# EAGLE design edubrm-shield-debug (EAGLE 5.11)
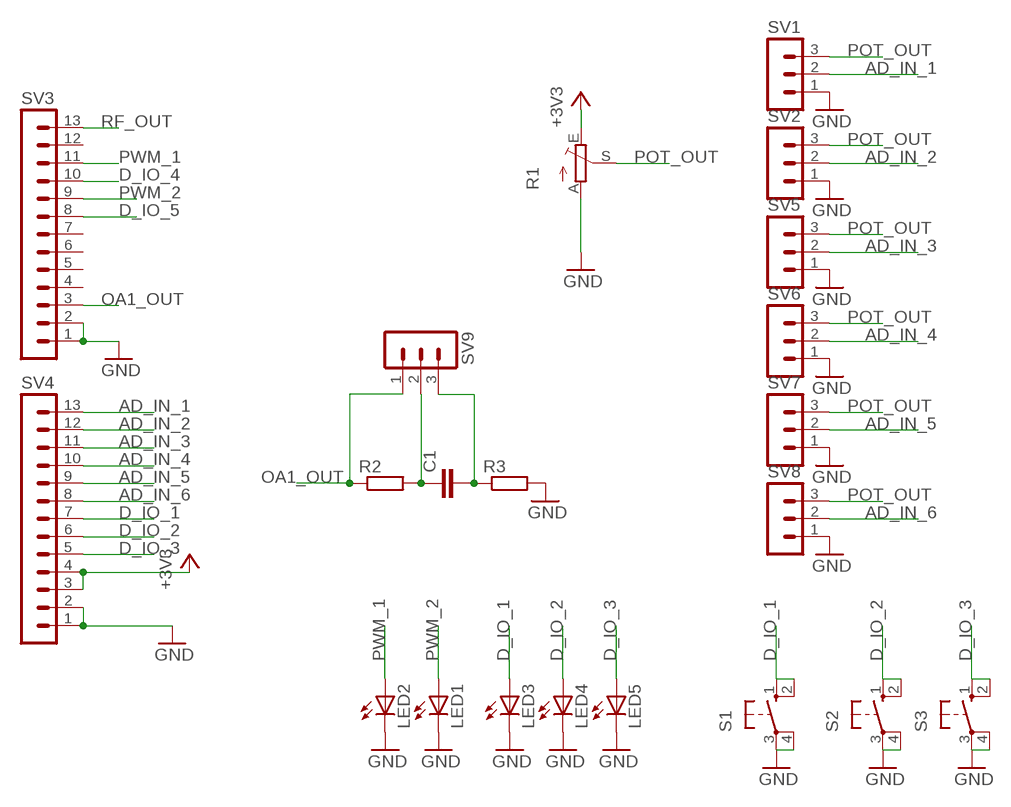
[diagram p0: schematic, sheet 1]

## Parts
C1  C-EU050-024X044  [C050-024X044]
LED1  LED3MM  [LED3MM]
LED2  LED3MM  [LED3MM]
LED3  LED3MM  [LED3MM]
LED4  LED3MM  [LED3MM]
LED5  LED3MM  [LED3MM]
R1  TRIM_EU-CIP20C-6MM  [CIP20C-6MM]
R2  R-EU_0207/10  [0207/10]
R3  R-EU_0207/10  [0207/10]
S1  10-XX  [B3F-10XX]
S2  10-XX  [B3F-10XX]
S3  10-XX  [B3F-10XX]
SV1  MA03-1  [MA03-1]
SV2  MA03-1  [MA03-1]
SV3  MA13-1  [MA13-1]
SV4  MA13-1  [MA13-1]
SV5  MA03-1  [MA03-1]
SV6  MA03-1  [MA03-1]
SV7  MA03-1  [MA03-1]
SV8  MA03-1  [MA03-1]
SV9  MA03-1  [MA03-1]

## Nets
AD_IN_1: SV1.2 SV4.13
AD_IN_2: SV2.2 SV4.12
AD_IN_3: SV4.11 SV5.2
AD_IN_4: SV4.10 SV6.2
AD_IN_5: SV4.9 SV7.2
AD_IN_6: SV4.8 SV8.2
D_IO_1: LED3.A S1.1(S) S1.2(S1) SV4.7
D_IO_2: LED4.A S2.1(S) S2.2(S1) SV4.6
D_IO_3: LED5.A S3.1(S) S3.2(S1) SV4.5
D_IO_4: SV3.10
D_IO_5: SV3.8
GND: LED1.K(C) LED2.K(C) LED3.K(C) LED4.K(C) LED5.K(C) R1.A R3.2 S1.3(P) S1.4(P1) S2.3(P) S2.4(P1) S3.3(P) S3.4(P1) SV1.1 SV2.1 SV3.1 SV3.2 SV4.1 SV4.2 SV5.1 SV6.1 SV7.1 SV8.1
N$1: C1.1 R2.2 SV9.2
N$2: C1.2 R3.1 SV9.3
OA1_OUT: R2.1 SV3.3 SV9.1
POT_OUT: R1.S SV1.3 SV2.3 SV5.3 SV6.3 SV7.3 SV8.3
PWM_1: LED2.A SV3.11
PWM_2: LED1.A SV3.9
RF_OUT: SV3.13
VCC: R1.E SV4.3 SV4.4 ; supply symbol labelled +3V3
Unconnected: SV3.4 SV3.5 SV3.6 SV3.7 SV3.12

## Library data of the parts
C1 = rcl:C-EU: CAPACITOR, European symbol
LED1-LED5 = led:LED: LED OSRAM: - CHIPLED LG R971, LG N971, LY N971, LG Q971, LY Q971, LO R971, LY R971 LH N974, LH R974 LS Q976, LO Q976, LY Q976 LO Q996 - Hyper CHIPLED LW Q18S LB Q993, LB Q99A, LB R99A - SideLED LS A670, LO A670, LY A670, LG A670, LP A670 LB A673, LV A673, LT A673, LW A673 LH A674 LY A675 LS A676, LA A676, LO A676, LY A676, LW A676 LS A679, LY A679, LG A679 - Hyper Micro SIDELED® LS Y876, LA Y876, LO Y876, LY Y876 LT Y87S - SmartLED LW L88C, LW L88S LB L89C, LB L89S, LG L890 LS L89K, LO L89K, LY L89K LS L896, LA L896, LO L896, LY L896 - TOPLED LS T670, LO T670, LY T670, LG T670, LP T670 LSG T670, LSP T670, LSY T670, LOP T670, LYG T670 LG T671, LOG T671, LSG T671 LB T673, LV T673, LT T673, LW T673 LH T674 LS T676, LA T676, LO T676, LY T676, LB T676, LH T676, LSB T676, LW T676 LB T67C, LV T67C, LT T67C, LS T67K, LO T67K, LY T67K, LW E67C LS E67B, LA E67B, LO E67B, LY E67B, LB E67C, LV E67C, LT E67C LW T67C LS T679, LY T679, LG T679 LS T770, LO T770, LY T770, LG T770, LP T770 LB T773, LV T773, LT T773, LW T773 LH T774 LS E675, LA E675, LY E675, LS T675 LS T776, LA T776, LO T776, LY T776, LB T776 LHGB T686 LT T68C, LB T68C - Hyper Mini TOPLED® LB M676 - Mini TOPLED Santana® LG M470 LS M47K, LO M47K, LY M47K Source: http://www.osram.convergy.de LUXEON: - LUMILED® LXK2-PW12-R00, LXK2-PW12-S00, LXK2-PW14-U00, LXK2-PW14-V00 LXK2-PM12-R00, LXK2-PM12-S00, LXK2-PM14-U00 LXK2-PE12-Q00, LXK2-PE12-R00, LXK2-PE12-S00, LXK2-PE14-T00, LXK2-PE14-U00 LXK2-PB12-K00, LXK2-PB12-L00, LXK2-PB12-M00, LXK2-PB14-N00, LXK2-PB14-P00, LXK2-PB14-Q00 LXK2-PR12-L00, LXK2-PR12-M00, LXK2-PR14-Q00, LXK2-PR14-R00 LXK2-PD12-Q00, LXK2-PD12-R00, LXK2-PD12-S00 LXK2-PH12-R00, LXK2-PH12-S00 LXK2-PL12-P00, LXK2-PL12-Q00, LXK2-PL12-R00 Source: www.luxeon.com KINGBRIGHT: KA-3528ASYC Source: www.kingbright.com
R1 = pot:TRIM_EU-: POTENTIOMETER
R2 R3 = rcl:R-EU_: RESISTOR, European symbol
S1-S3 = switch-omron:10-XX: OMRON SWITCH; MPN: B3F-1000; OC_FARNELL: 176432; OC_NEWARK: 36M3542
SV1 SV2 SV5-SV9 = con-lstb:MA03-1: PIN HEADER; OC_FARNELL: unknown; OC_NEWARK: unknown
SV3 SV4 = con-lstb:MA13-1: PIN HEADER; OC_FARNELL: unknown; OC_NEWARK: unknown

## Board
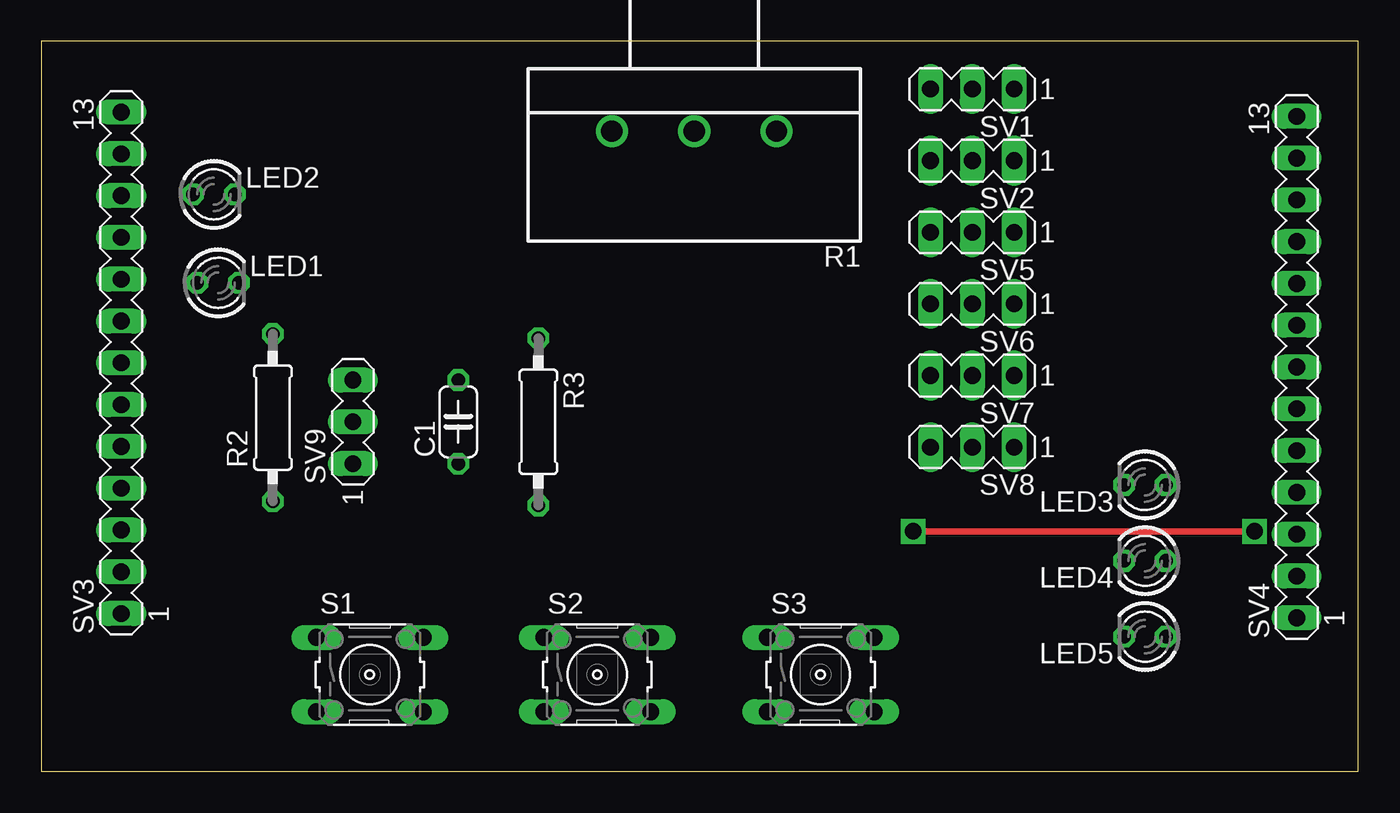
[diagram p1: board, top side]
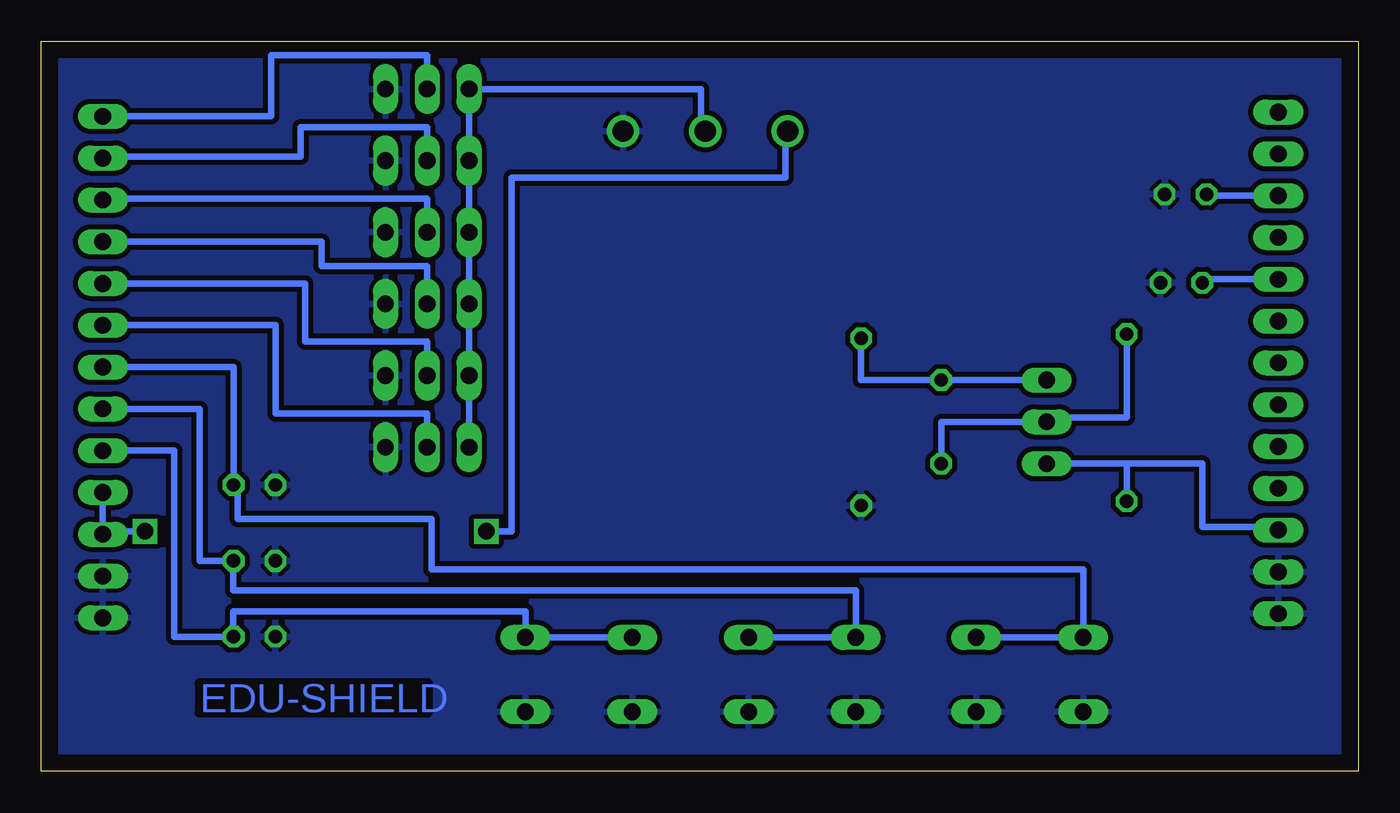
[diagram p2: board, bottom side, seen from below]

Size 80.03 x 44.38 mm. Coordinates in mm from the lower left corner, seen from the top.
Outline: 0,0 80.03,0 80.03,44.38 0,44.38 0,0
Copper layers (1*16): Top 0.035mm / dielectric 1.5mm / Bottom 0.035mm
Design rules "default *": minimum track width 10mil, minimum drill 24mil, track to track 12mil, track to pad 12mil, pad to pad 8mil, via to via 8mil, smd to smd 8mil, copper to edge 40mil, drill to drill 8mil, minimum pad ring 10mil, minimum via ring 8mil, stop-mask expansion 4mil, vias tented up to drill 0mil, thermal gap 10mil

### Footprints (pad centres in the part's own frame; a part is rotated, then mirrored left to right if it is on the bottom)
C050-024X044 = drill 0.813 octagon: 1 -2.54,0; 2 2.54,0
LED3MM = drill 0.813 octagon: A -1.27,0; K 1.27,0
CIP20C-6MM = drill 1.3 pad 1.93 round: A -5,0; E 5,0; S 0,0
0207/10 = drill 0.813 octagon: 1 -5.08,0; 2 5.08,0
B3F-10XX = drill 1.016 long: 1 -3.251,2.261; 2 3.251,2.261; 3 -3.251,-2.261; 4 3.251,-2.261
MA03-1 = drill 1.016 long: 1 -2.54,0; 2 0,0; 3 2.54,0
MA13-1 = drill 1.016 long: 1 -15.24,0; 2 -12.7,0; 3 -10.16,0; 4 -7.62,0; 5 -5.08,0; 6 -2.54,0; 7 0,0; 8 2.54,0; 9 5.08,0; 10 7.62,0; 11 10.16,0; 12 12.7,0; 13 15.24,0

### Placement (x,y rotation side)
C1  25.34,21.25 90 top
LED1  10.75,29.7 0 top
LED2  10.5,35.07 0 top
LED3  67.07,17.41 180 top
LED4  67.07,12.8 180 top
LED5  67.07,8.19 180 top
R1  39.68,38.91 180 top
R2  14.08,21.5 90 top
R3  30.21,21.25 270 top
S1  19.97,5.89 0 top
S2  33.79,5.89 0 top
S3  47.36,5.89 0 top
SV1  56.58,41.47 180 top
SV2  56.58,37.12 180 top
SV3  4.86,24.83 90 top
SV4  76.29,24.58 90 top
SV5  56.58,32.77 180 top
SV6  56.58,28.42 180 top
SV7  56.58,24.06 180 top
SV8  56.58,19.71 180 top
SV9  18.94,21.25 90 top

### Tracks (layer width: path | path; a pad name or v marks a point on that pad's centre or on a via)
AD_IN_1
  Bottom 0.406: SV1.2 56.58,43.52 66.05,43.52 66.05,39.82 SV4.13
AD_IN_2
  Bottom 0.406: SV2.2 56.58,39.17 64.26,39.17 64.26,37.38 76.29,37.38 SV4.12
AD_IN_3
  Bottom 0.406: SV5.2 56.58,34.82 76.29,34.82 SV4.11
AD_IN_4
  Bottom 0.406: SV6.2 56.58,30.72 62.98,30.72 62.98,32.2 SV4.10
AD_IN_5
  Bottom 0.406: SV7.2 56.58,26.11 64,26.11 64,29.66 SV4.9
AD_IN_6
  Bottom 0.406: SV8.2 56.58,21.76 65.79,21.76 65.79,27.12 SV4.8
D_IO_1
  Bottom 0.406: SV4.7 68.34,24.58 LED3.A 68.1,17.41 68.1,15.36 56.32,15.36 56.32,12.29 16.72,12.29 S1.1 S1.2
D_IO_2
  Bottom 0.406: SV4.6 70.4,22.04 70.4,12.8 LED4.A 68.35,11.01 30.54,11.01 S2.1 S2.2
D_IO_3
  Bottom 0.406: SV4.5 71.94,19.5 71.94,8.19 LED5.A 68.35,9.73 50.61,9.73 S3.2 S3.1
GND
  pour Bottom: -1.54,45.57 81.66,45.57 81.66,-1.79 -1.54,-1.79
N$1
  Bottom 0.406: R2.2 14.08,21.5 18.94,21.5 SV9.2 25.34,21.25 C1.1
N$2
  Bottom 0.406: SV9.3 C1.2 30.21,23.79 R3.1
OA1_OUT
  Bottom 0.406: R2.1 14.08,18.71 SV9.1 9.47,18.71 9.47,14.85 4.86,14.85 SV3.3
POT_OUT
  Bottom 0.406: R1.S 39.94,38.91 39.94,41.47 SV1.3 SV2.3 SV5.3 SV6.3 SV7.3 SV8.3
PWM_1
  Bottom 0.406: SV3.11 9.23,34.99 LED2.A
PWM_2
  Bottom 0.406: SV3.9 9.48,29.91 LED1.A
VCC  (via drill 1)
  Top 0.406: v52.99,14.59 v73.73,14.59
  Bottom 0.406: R1.E 34.82,38.91 34.82,36.1 51.46,36.1 51.46,14.59 v52.99,14.59 | v73.73,14.59 76.29,14.59 | 76.29,14.59 SV4.3 | 76.29,14.59 SV4.4

### Text on the board
Bottom: EDU-SHIELD